# Altium schematic sheet Autoswitch.SchDoc
size A4; SheetNumber: 3; SheetTotal: 6
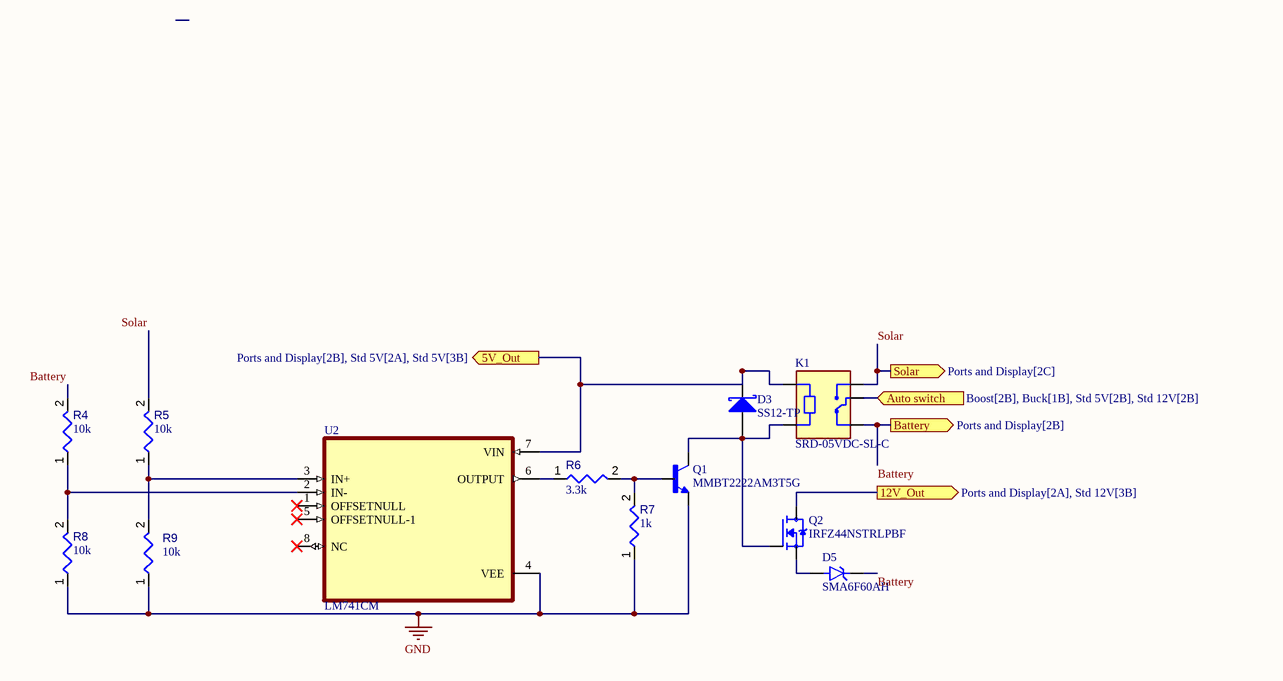
[diagram p0: Autoswitch.SchDoc]

## Parts
D3  SS12-TP  [MCC-DO-214AC-2_V]
D5  SMA6F60AH  [SODFL5226X100N]
K1  SRD-05VDC-SL-C  [RELAY_SRD-05VDC-SL-C]
Q1  MMBT2222AM3T5G  [SOT95P240X120-3N]
Q2  IRFZ44NSTRLPBF  [DPAK254P1524X483-3N]
R4  value 10k  [RESC0805(2012)_L]  (hidden comment: 1KR5J)
R5  value 10k  [RESC0805(2012)_L]  (hidden comment: 1KR5J)
R6  value 3.3k  [RESC0805(2012)_L]  (hidden comment: 1KR5J)
R7  value 1k  [RESC0805(2012)_L]  (hidden comment: 1KR5J)
R8  value 10k  [RESC0805(2012)_L]  (hidden comment: 1KR5J)
R9  value 10k  [RESC0805(2012)_L]  (hidden comment: 1KR5J)
U2  LM741CM  [SOIC127P599X175-8N]

## Ports
5V_Out (out, see Ports and Display[2B], Std 5V[2A], Std 5V[3B]), 12V_Out (out, see Ports and Display[2A], Std 12V[3B]), Auto switch (in, see Boost[2B], Buck[1B], Std 5V[2B], Std 12V[2B]), Battery (out, see Ports and Display[2B]), Solar (out, see Ports and Display[2C])

## Nets
GND: Q1.2(E) R7.1 R8.1 R9.1 U2.4(VEE)
5V_Out: D3.2(K) K1.A1 U2.7(VIN) ; port 5V_Out
12V_Out: Q2.2(D) ; port 12V_Out
Auto switch: K1.COM ; port Auto switch
Battery: D5.1(K) K1.NC R4.2 ; port Battery
Solar: K1.NO R5.2 ; port Solar
NetD3_1: D3.1(A) K1.A2 Q1.3(C) Q2.1(G)
NetD5_2: D5.2(A) Q2.3(S)
NetQ1_1: Q1.1(B) R6.2 R7.2
NetR4_1: R4.1 R8.2 U2.2(IN-)
NetR5_1: R5.1 R9.2 U2.3(IN+)
NetR6_1: R6.1 U2.6(OUTPUT)

Not connected (* = marked no-connect by the designer): U2 1(OFFSETNULL)* 5(OFFSETNULL-1)* 8(NC)*

## Library data of the parts
D3 = CMP-004-00018-2: Schottky Rectifier, 20 V, 1 A, -55 to 125 degC, 2-Pin DO-214AC, RoHS, Tape and Reel; Manufacturer: Micro Commercial Components; Forward Voltage: 450mV; Max Surge Current: 30A; Forward Current: 1A; Peak Reverse Current: 500uA; Package Quantity: 1; Packaging: CutTape; Datasheet Version: Rev. B, 11/2011; Manufacturer URL: http://www.mccsemi.com/; Max Operating Temperature: 125°C; Pins: 2; Min Operating Temperature: -55°C; Package Reference: DO-214AC-2; Case/Package: SMA; Package Description: 2-Pin Molded Diode, Body 4.315 x 2.705 mm; Mounting Technology: SM; Datasheet URL: http://www.mccsemi.com/up_pdf/SS12-SS110(HSMA).PDF; RoHS Compliant: True
D5 = CMP-004-00031-1: 600W, 70.6V, 5%, Unidirectional, TVS; MF: Taiwan Semiconductor; Design Item ID: SMA6F60AH; Value: *; Case/Package: THIN SMA-2 Taiwan Semiconductor; Source: SMA6F60AH.SchLib; MP: SMA6F60AH; Component Type: Standard; SnapEDA_Link: https://www.snapeda.com/parts/SMA6F60AH/taiwan/view-part/?ref=snap; Check_prices: https://www.snapeda.com/parts/SMA6F60AH/taiwan/view-part/?ref=eda; Pins: 2
K1 = CMP-015-000000-1: 5V Trigger Relay Module For Arduino And Raspberry Pi 5V Trigger Relay Module For Arduino And Raspberry Pi; MF: Songle Relay; Check_prices: https://www.snapeda.com/parts/SRD-05VDC-SL-C/Songle+Relay/view-part/?ref=eda; Value: *; Pin Count: 5; Availability: Not in stock; Design Item ID: SRD-05VDC-SL-C; SnapEDA_Link: https://www.snapeda.com/parts/SRD-05VDC-SL-C/Songle+Relay/view-part/?ref=snap; Source: SRD-05VDC-SL-C.SchLib; Package: NON STANDARD-5 Songle Relay; Component Type: Standard; MP: SRD-05VDC-SL-C; Price: None
Q1 = CMP-017-000000-2: BJT, SOT-23, 40V, 600mA, NPN, 0.25W, 150°C; MF: Diotec Semiconductor; Design Item ID: MMBT2222A; Check_prices: https://www.snapeda.com/parts/MMBT2222A/Diotec/view-part/?ref=eda; MP: MMBT2222A; Component Type: Standard; Pin Count: 3; Source: MMBT2222A.SchLib; Value: *; SnapEDA_Link: https://www.snapeda.com/parts/MMBT2222A/Diotec/view-part/?ref=snap; Package: SOT-23 Diotec
Q2 = CMP-027-000000-1: RoHS Compliant; MF: Infineon Technologies; SnapEDA_Link: https://www.snapeda.com/parts/IRFZ44NSTRLPBF/Infineon+Technologies/view-part/?ref=snap; MP: IRFZ44NSTRLPBF; Pin Count: 3; Source: IRFZ44NSTRLPBF.SchLib; Package: D2PAK Infineon; Value: *; Component Type: Standard; Design Item ID: IRFZ44NSTRLPBF; Check_prices: https://www.snapeda.com/parts/IRFZ44NSTRLPBF/Infineon+Technologies/view-part/?ref=eda
R4-R9 = CMP-009-00076-2: 1K 0.125W 5% 0805 (2012 Metric)  SMD; Power: 125mW; Pins: 2; Mounting Technology: SMT; Tolerance: 5%; Case/Package: 0805
U2 = CMP-014-00005-1: General Purpose Amplifier 1 Circuit 8-SOIC; MF: Fairchild Semiconductor; Design Item ID: LM741CM; Value: *; SnapEDA_Link: https://www.snapeda.com/parts/LM741CM/Fairchild+Imaging/view-part/?ref=snap; Check_prices: https://www.snapeda.com/parts/LM741CM/Fairchild+Imaging/view-part/?ref=eda; Pins: 8; Component Type: Standard; Source: LM741CM.SchLib; Case/Package: SOIC-8 ON Semiconductor; MP: LM741CM